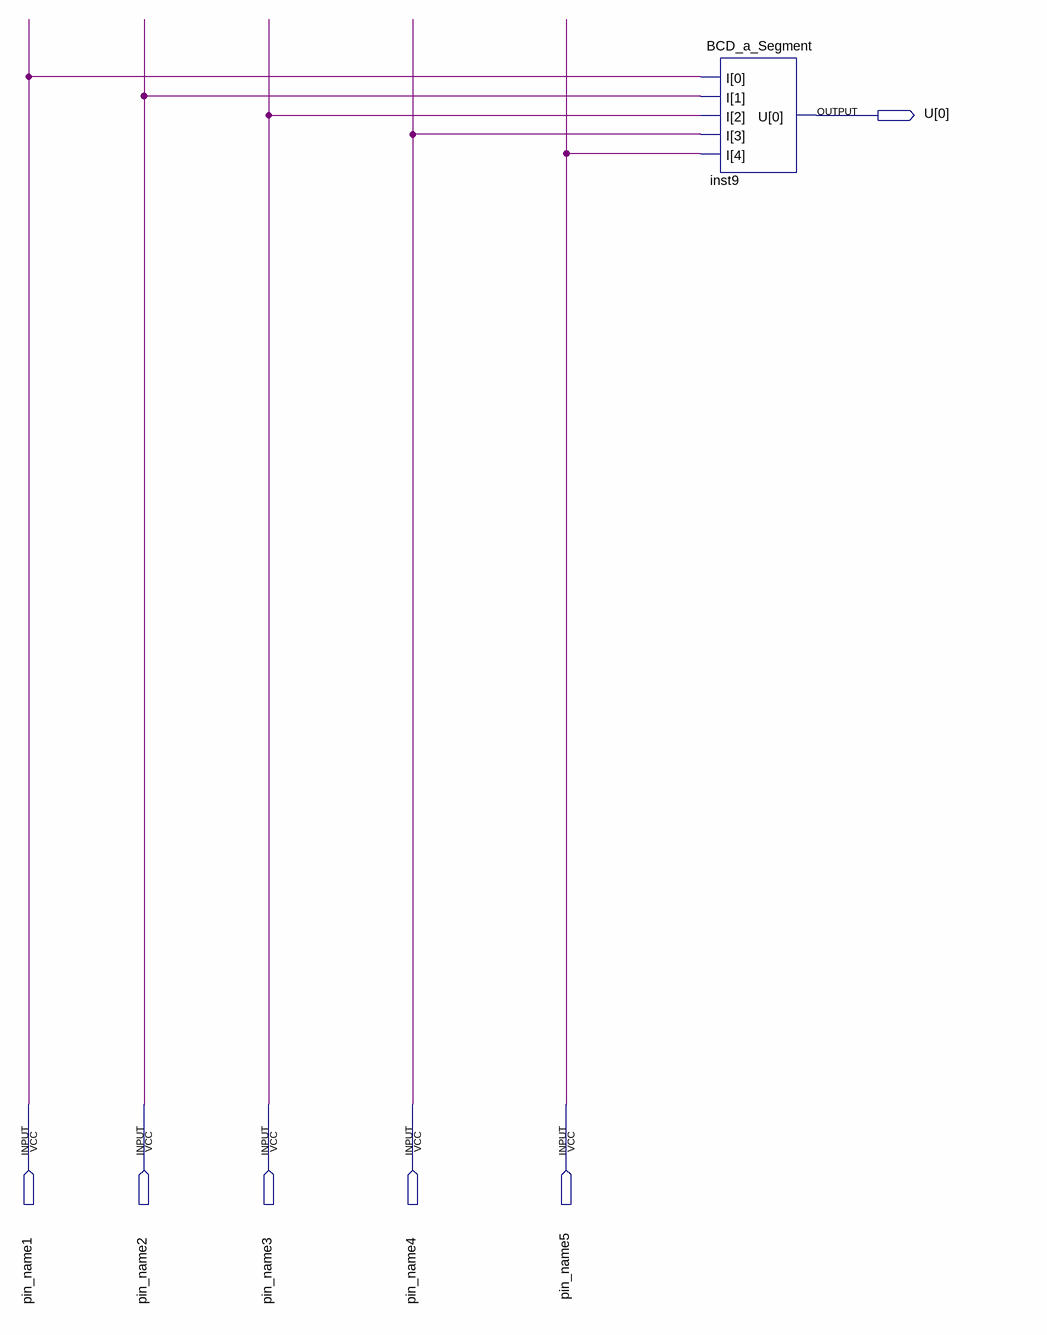
[diagram p0: schematic sheet]
// Quartus schematic Ula_pjct.bdf as structural Verilog: 1 symbols, 6 pins
module Ula_pjct (
  input  pin_name1,
  input  pin_name2,
  input  pin_name3,
  input  pin_name4,
  input  pin_name5,
  output [0:0] U
);

  BCD_a_Segment inst9 (.I({pin_name5, pin_name4, pin_name3, pin_name2, pin_name1}), .U(U[0]));
endmodule
